# EasyEDA Pro project Main.eprj, schematic k230D
Board Name: k230D; Create Date: 2026-01-29; Page Name: v1; Project Name: Main; Schematic Name: k230D; Update Date: 2026-05-21; File: powermanagmen; Id: /; Sheet: /
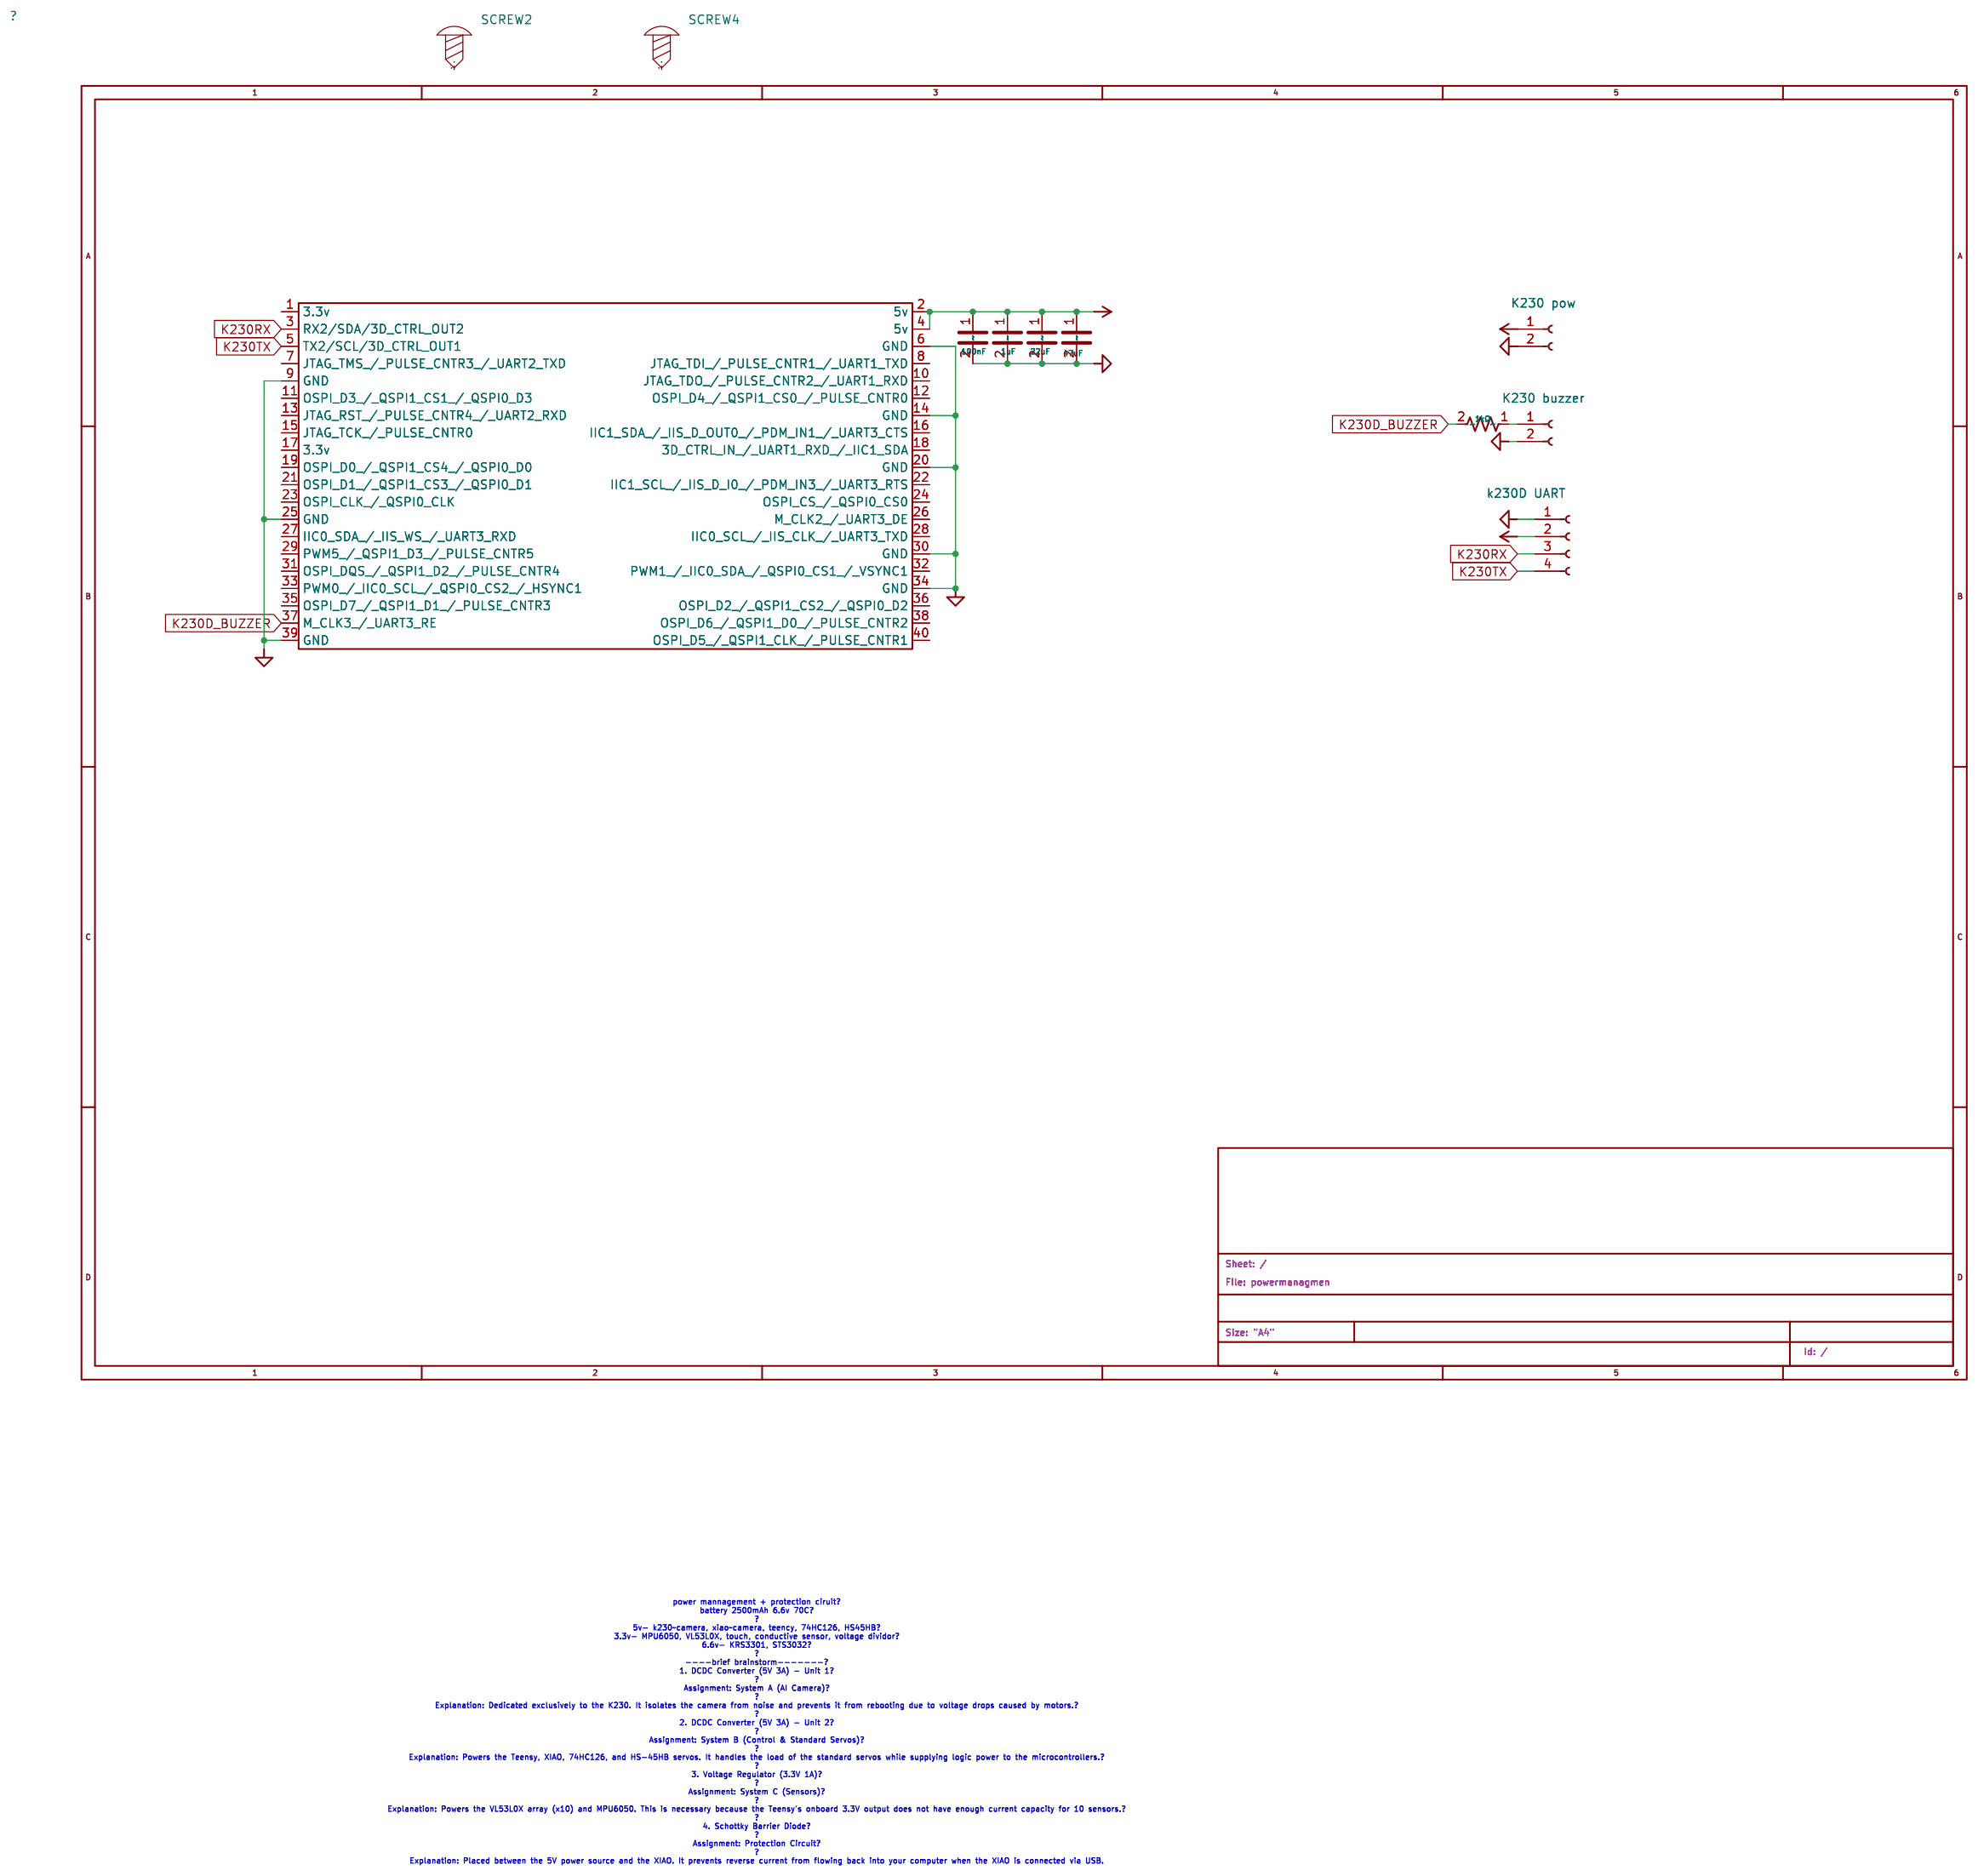
[diagram p2: schematic sheet]

## Parts
C1  100nF  [C0603]
C2  1uF  [C0603]
C3  22uF  [C0603]
C4  47uF  [C0603]
J1  K230 pow  [CONN-TH_2P-P2.50_HX25003-2A]
J2  k230D UART  [CONN-TH_B4B-XH-A-BK-LF-SN]
J3  K230 buzzer  [CONN-TH_2P-P2.50_HX25003-2A]
R1  1kΩ  [R0603]
SCREW2  -  [Screw-Hole-M2]
SCREW4  -  [Screw-Hole-M2]
U1  FH-00148  [HDR-TH_40P-P2.54_FFH25405-D40S1001K6K]

## Library data of the parts
C1 = TCC0603X7R104K500CT: Capacitance:100nF Tolerance:±10% Tolerance:±10% Voltage Rating:50V Temperature Coefficient:X7R; LCSC Part Name: 100nF ±10% 50V; Supplier Part: C282519; Manufacturer: CCTC(三环); Supplier Footprint: 0603; JLCPCB Part Class: Extended Part; Datasheet: https://item.szlcsc.com/datasheet/TCC0603X7R104K500CT/268639.html; Supplier: LCSC; Tolerance: ±10%; Voltage Rating: 50V; Temperature Coefficient: X7R
C2 = CL10A105KB8NNNC: Capacitance:1uF Tolerance:±10% Tolerance:±10% Voltage Rating:50V Temperature Coefficient:X5R; LCSC Part Name: 1uF ±10% 50V; Supplier Part: C15849; Manufacturer: SAMSUNG(三星); Supplier Footprint: 0603; JLCPCB Part Class: Basic Part; Datasheet: https://item.szlcsc.com/datasheet/CL10A105KB8NNNC/16531.html; Supplier: LCSC; Tolerance: ±10%; Voltage Rating: 50V; Temperature Coefficient: X5R
C3 = CL10A226MP8NUNE: Capacitance:22uF Tolerance:±20% Tolerance:±20% Voltage Rating:10V Temperature Coefficient:X5R; LCSC Part Name: 22uF ±20% 10V; Supplier Part: C86295; Manufacturer: SAMSUNG(三星); Supplier Footprint: 0603; JLCPCB Part Class: Extended Part; Datasheet: https://item.szlcsc.com/datasheet/CL10A226MP8NUNE/87471.html; Supplier: LCSC; Tolerance: ±20%; Voltage Rating: 10V; Temperature Coefficient: X5R
C4 = GRM188R60J476ME15D: Capacitance:47uF Tolerance:±20% Tolerance:±20% Voltage Rating:6.3V Temperature Coefficient:X5R; LCSC Part Name: 47uF ±20% 6.3V; Supplier Part: C140782; Manufacturer: muRata(村田); Supplier Footprint: 0603; JLCPCB Part Class: Extended Part; Datasheet: https://item.szlcsc.com/datasheet/GRM188R60J476ME15D/152108.html; Supplier: LCSC; Tolerance: ±20%; Voltage Rating: 6.3V; Temperature Coefficient: X5R
J1 J3 = B2B-XH-A(LF)(SN): Pins Structure:1x2P Pitch:2.5mm Mounting Type:Through Hole Reference Series:XH Number of Pins:2P Number of Rows:1 Number of PINs Per Row:2 Row Spacing:- Current Rating:3A Contact Material:Brass Contact Plating:Tin Operating Temperature:-25℃~+85℃ Operating; LCSC Part Name: 1x2P 间距:2.5mm 直插 系列:XH; Supplier Part: C158012; Manufacturer: JST; Supplier Footprint: 插件,P=2.5mm; JLCPCB Part Class: Extended Part; Datasheet: https://item.szlcsc.com/datasheet/B2B-XH-A(LF)(SN)/169360.html; Supplier: LCSC; Pins Structure: 1x2P; Pitch: 2.5mm; Mounting Type: Through Hole; Reference Series: XH; Number of Pins: 2P; Number of Rows: 1; Number of PINs Per Row: 2; Current Rating: 3A; Contact Material: Brass; Contact Plating: Tin; Operating Temperature: -25℃~+85℃; Voltage Rating: 250V; Plastic Material: PA66; Flame Retardant Rating: UL94V-0; Supplementary Features: K Pin; Color: White; Z-Height of the Board: 7mm; X-Length of Bottom Edge on Board (Spacing Line): 7.4mm; Y-Width of Bottom Edge on Board: 5.75mm
J2 = B4B-PH-K-S(LF)(SN)_C131334: Pins Structure:1x4P Pitch:2mm Mounting Type:Through Hole Reference Series:PH Number of Pins:4P Number of Rows:1 Number of PINs Per Row:4 Row Spacing:- Current Rating:2A Contact Material:Brass Contact Plating:Tin Operating Temperature:-25℃~+85℃ Operating T; LCSC Part Name: 1x4P 间距:2mm 直插 系列:PH; Supplier Part: C131334; Manufacturer: JST; Manufacturer Part: B4B-PH-K-S(LF)(SN); Supplier Footprint: 插件,P=2mm; JLCPCB Part Class: Extended Part; Datasheet: https://item.szlcsc.com/datasheet/B4B-PH-K-S(LF)(SN)/142627.html; Supplier: LCSC; Pins Structure: 1x4P; Pitch: 2mm; Mounting Type: Through Hole; Reference Series: PH; Number of Pins: 4P; Number of Rows: 1; Number of PINs Per Row: 4; Current Rating: 2A; Contact Material: Brass; Contact Plating: Tin; Operating Temperature: -25℃~+85℃; Voltage Rating: 100V; Plastic Material: PA66; Flame Retardant Rating: UL94V-0; Supplementary Features: K Pin; Color: White; Z-Height of the Board: 6mm; X-Length of Bottom Edge on Board (Spacing Line): 9.9mm; Y-Width of Bottom Edge on Board: 4.5mm
R1 = 0603WAF1001T5E: Type:Thick Film Resistor Resistance:1kΩ Tolerance:±1% Tolerance:±1% Power(Watts):100mW Voltage-Supply(Max):75V Temperature Coefficient:±100ppm/℃ Temperature Coefficient:±100ppm/℃ Operating Temperature:-55℃~+155℃ Operating Temperature:-55℃~+155℃; LCSC Part Name: 1kΩ ±1% 100mW 厚膜电阻; Supplier Part: C21190; Manufacturer: UNI-ROYAL(厚声); Supplier Footprint: 0603; JLCPCB Part Class: Basic Part; Datasheet: https://item.szlcsc.com/datasheet/0603WAF1001T5E/21904.html; Supplier: LCSC; Type: Thick Film Resistor; Tolerance: ±1%; Power(Watts): 100mW; Voltage-Supply(Max): 75V; Temperature Coefficient: ±100ppm/℃; Operating Temperature: -55℃~+155℃
SCREW2 SCREW4 = Screw-Hole-M2: Supplier Footprint: 插件
U1 = FH-00148: Holes Structure:2x20P Pitch:2.54mm Row Spacing:2.54mm Circular Hole / Square Hole:Square Hole Mounting Type:Surface Mount,Vertical Number of Rows:2 Number of Positions:40P Current Rating:3A Voltage Rating (Max):- Holes Direction:Top Insulation Height:7.1m; LCSC Part Name: 间距:2.54mm 2x20P 立贴; Supplier Part: C2685092; Manufacturer: Liansheng(连盛); Supplier Footprint: SMD,P=2.54mm; JLCPCB Part Class: Extended Part; Datasheet: https://item.szlcsc.com/datasheet/FH-00148/2784366.html; Supplier: LCSC; Holes Structure: 2x20P; Pitch: 2.54mm; Row Spacing: 2.54mm; Circular Hole / Square Hole: Square Hole; Mounting Type: Surface Mount,Vertical; Number of Rows: 2; Number of Positions: 40P; Current Rating: 3A; Holes Direction: Top; Insulation Height: 7.1mm; Contact Material: Brass; Contact Plating: Gold; Operating Temperature: -40℃~+105℃

## Nets
+5V: C1.1 C2.1 C3.1 C4.1 J1.1(Pin) J2.2(Pin) U1.2(5v) U1.4(5v)
K230D_BUZZER: R1.2 U1.37(M_CLK3_/_UART3_RE)
K230RX: J2.3(Pin) U1.3(RX2/SDA/3D_CTRL_OUT2)
K230TX: J2.4(Pin) U1.5(TX2/SCL/3D_CTRL_OUT1)
POWER_GND: C1.2 C2.2 C3.2 C4.2 J1.2(Pin) J2.1(Pin) J3.2(Pin) U1.6(GND) U1.9(GND) U1.14(GND) U1.20(GND) U1.25(GND) U1.30(GND) U1.34(GND) U1.39(GND)
$1N12598: J3.1(Pin) R1.1

Not connected (* = marked no-connect by the designer): SCREW2 1; SCREW4 1; U1 1(3.3v) 7(JTAG_TMS_/_PULSE_CNTR3_/_UART2_TXD) 8(JTAG_TDI_/_PULSE_CNTR1_/_UART1_TXD) 10(JTAG_TDO_/_PULSE_CNTR2_/_UART1_RXD) 11(OSPI_D3_/_QSPI1_CS1_/_QSPI0_D3) 12(OSPI_D4_/_QSPI1_CS0_/_PULSE_CNTR0) 13(JTAG_RST_/_PULSE_CNTR4_/_UART2_RXD) 15(JTAG_TCK_/_PULSE_CNTR0) 16(IIC1_SDA_/_IIS_D_OUT0_/_PDM_IN1_/_UART3_CTS) 17(3.3v) 18(3D_CTRL_IN_/_UART1_RXD_/_IIC1_SDA) 19(OSPI_D0_/_QSPI1_CS4_/_QSPI0_D0) 21(OSPI_D1_/_QSPI1_CS3_/_QSPI0_D1) 22(IIC1_SCL_/_IIS_D_I0_/_PDM_IN3_/_UART3_RTS) 23(OSPI_CLK_/_QSPI0_CLK) 24(OSPI_CS_/_QSPI0_CS0) 26(M_CLK2_/_UART3_DE) 27(IIC0_SDA_/_IIS_WS_/_UART3_RXD) 28(IIC0_SCL_/_IIS_CLK_/_UART3_TXD) 29(PWM5_/_QSPI1_D3_/_PULSE_CNTR5) 31(OSPI_DQS_/_QSPI1_D2_/_PULSE_CNTR4) 32(PWM1_/_IIC0_SDA_/_QSPI0_CS1_/_VSYNC1) 33(PWM0_/_IIC0_SCL_/_QSPI0_CS2_/_HSYNC1) 35(OSPI_D7_/_QSPI1_D1_/_PULSE_CNTR3) 36(OSPI_D2_/_QSPI1_CS2_/_QSPI0_D2) 38(OSPI_D6_/_QSPI1_D0_/_PULSE_CNTR2) 40(OSPI_D5_/_QSPI1_CLK_/_PULSE_CNTR1)

## Notes on the sheet
- power mannagement + protection ciruit
  battery 2500mAh 6.6v 70C
  5v- k230~camera, xiao~camera, teency, 74HC126, HS45HB
  3.3v- MPU6050, VL53L0X, touch, conductive sensor, voltage dividor
  6.6v- KRS3301, STS3032
  ----brief brainstorm-------
  1. DCDC Converter (5V 3A) - Unit 1
  Assignment: System A (AI Camera)
  Explanation: Dedicated exclusively to the K230. It isolates the camera from noise and prevents it from rebooting due to voltage drops caused by motors.
  2. DCDC Converter (5V 3A) - Unit 2
  Assignment: System B (Control & Standard Servos)
  Explanation: Powers the Teensy, XIAO, 74HC126, and HS-45HB servos. It handles the load of the standard servos while supplying logic power to the microcontrollers.
  3. Voltage Regulator (3.3V 1A)
  Assignment: System C (Sensors)
  Explanation: Powers the VL53L0X array (x10) and MPU6050. This is necessary because the Teensy's onboard 3.3V output does not have enough current capacity for 10 sensors.
  4. Schottky Barrier Diode
  Assignment: Protection Circuit
  Explanation: Placed between the 5V power source and the XIAO. It prevents reverse current from flowing back into your computer when the XIAO is connected via USB.
